# EAGLE design SparkX_Micro_NFC_RFID_Tag (EAGLE 9.6.2)
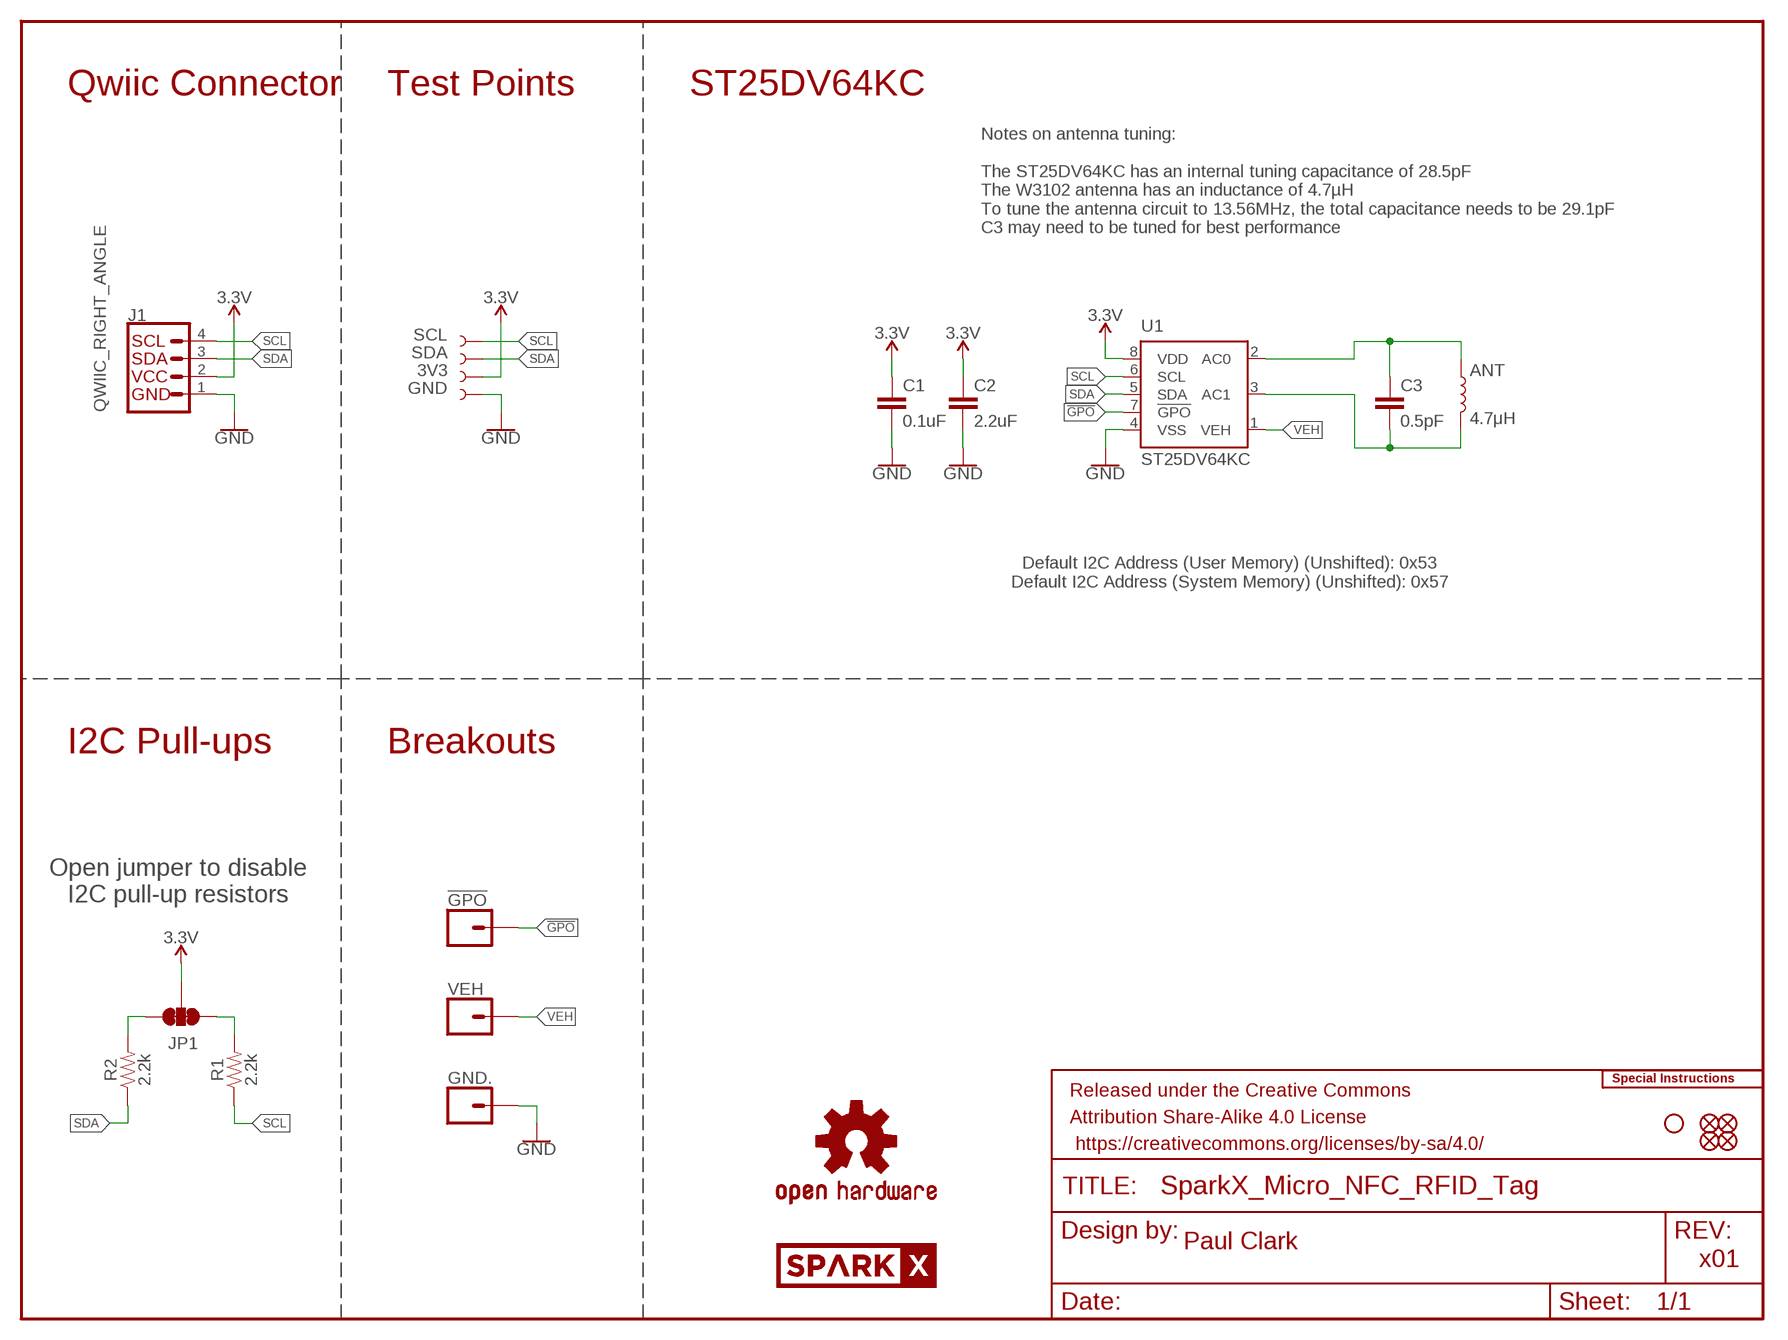
[diagram p0: schematic, sheet 1]

## Parts
3V3  TEST-POINT3  [PAD.03X.03]
!GPO!  CONN_01_1MM  [1X01_1MM_NO_SILK]
ANT  4.7μH  RFID_ANTENNA_W3102  [W3102]
C1  0.1uF  0.1UF-0402T-6.3V-10%-X7R  [0402-TIGHT]
C2  2.2uF  2.2UF-0402_TIGHT-10V-10%-X5R  [0402-TIGHT]
C3  0.5pF  0.5PF-0402_TIGHT-50V-PM0.05PF-NP0  [0402-TIGHT]
FD1  FIDUCIALUFIDUCIAL  [FIDUCIAL-MICRO]
FD2  FIDUCIALUFIDUCIAL  [FIDUCIAL-MICRO]
FD3  FIDUCIALUFIDUCIAL  [FIDUCIAL-MICRO]
FD4  FIDUCIALUFIDUCIAL  [FIDUCIAL-MICRO]
FRAME2  FRAME-LETTER  [CREATIVE_COMMONS]
GND  TEST-POINT3  [PAD.03X.03]
GND.  CONN_01_1MM  [1X01_1MM_NO_SILK]
H1  STAND-OFFTIGHT  [STAND-OFF-TIGHT]
J1  QWIIC_RIGHT_ANGLE  QWIIC_CONNECTORJS-1MM  [JST04_1MM_RA]
JP1  JUMPER-SMT_3_2-NC_TRACE_SILK  [SMT-JUMPER_3_2-NC_TRACE_SILK]
LOGO1  SPECIAL_INSTRUCTIONS-ORDERING  [ORDERING_INSTRUCTIONS]
LOGO2  OSHW-LOGOMINI  [OSHW-LOGO-MINI]
R1  2.2k  2.2KOHM-0402T-1/16W-1%  [0402-TIGHT]
R2  2.2k  2.2KOHM-0402T-1/16W-1%  [0402-TIGHT]
SCL  TEST-POINT3  [PAD.03X.03]
SDA  TEST-POINT3  [PAD.03X.03]
U1  ST25DV64KC  [SO08]
U$1  SPARKX-LOGO2  [SPARKX-TINY]
VEH  CONN_01_1MM  [1X01_1MM_NO_SILK]

## Nets
3.3V: 3V3.1 C1.1 C2.1 J1.2 JP1.2 U1.8(VDD)
!GPO!: !GPO!.1 U1.7(!GPO!)
GND: C1.2 C2.2 GND.1 GND..1 J1.1 U1.4(VSS)
N$1: ANT.2 C3.2 U1.3(AC1)
N$2: ANT.1 C3.1 U1.2(AC0)
N$3: JP1.3 R2.2
N$4: JP1.1 R1.2
SCL: J1.4 R1.1 SCL.1 U1.6(SCL)
SDA: J1.3 R2.1 SDA.1 U1.5(SDA)
VEH: U1.1(VEH) VEH.1

## Notes on the sheet
- Qwiic Connector | Test Points | ST25DV64KC
- Notes on antenna tuning:
  
  The ST25DV64KC has an internal tuning capacitance of 28.5pF
  The W3102 antenna has an inductance of 4.7µH
  To tune the antenna circuit to 13.56MHz, the total capacitance needs to be 29.1pF
  C3 may need to be tuned for best performance
- Default I2C Address (User Memory) (Unshifted): 0x53
  Default I2C Address (System Memory) (Unshifted): 0x57
- I2C Pull-ups | Breakouts
- Open jumper to disable
  I2C pull-up resistors
- Paul Clark
- x01

## Library data of the parts
3V3 GND SCL SDA = SparkFun-Connectors:TEST-POINT: SparkFun Test Points Bare copper test points for troubleshooting or In-Circuit-Testing. These are used by our Production team for verifying production board runs using pogo-pins on test beds. SparkFun Products: SparkFun LSM9DS1 Breakout <https://www.sparkfun.com/products/13284> SparkFun PSOC <https://www.sparkfun.com/products/13714> SparkFun Load Cell Amplifier <https://www.sparkfun.com/products/13879>
!GPO! GND. VEH = SparkFun-Connectors:CONN_01: Single connection point. Often used as Generic Header-pin footprint for 0.1 inch spaced/style header connections On any of the 0.1 inch spaced packages, you can populate with these: Break Away Headers - Straight <https://www.sparkfun.com/products/116> (PRT-00116) Break Away Male Headers - Right Angle <https://www.sparkfun.com/products/553> (PRT-00553) Female Headers <https://www.sparkfun.com/products/115> (PRT-00115) Break Away Headers - Machine Pin <https://www.sparkfun.com/products/117> (PRT-00117) Break Away Female Headers - Swiss Machine Pin <https://www.sparkfun.com/products/743> (PRT-00743) This device is also useful as a general connection point to wire up your design to another part of your project. Our various solder wires solder well into these plated through hole pads. Hook-Up Wire - Assortment (Stranded, 22 AWG) <https://www.sparkfun.com/products/11375> (PRT-11375) Hook-Up Wire - Assortment (Solid Core, 22 AWG) <https://www.sparkfun.com/products/11367> (PRT-11367) View the entire wire category on our website here <https://www.sparkfun.com/categories/141> Special notes: SMTSO-256-ET is a "flush mount" nut for a 4-40 screw. We mostly use this on specialty testbeds; it is a nice way to connect hardware to your PCB at an adjustable hieght. Also note, the SNAP packages are for using a snappable style connector. We sell a baggie of snaps and they are also used on two LilyPad designs: Snap Assortment - 30 pack (male and female) <https://www.sparkfun.com/products/11347> (DEV-11347) LilyPad Arduino SimpleSnap <https://www.sparkfun.com/products/10941> (DEV-10941) LilyPad SimpleSnap Protoboard <https://www.sparkfun.com/products/10940> (DEV-10940)
ANT = SparkFun-RF:RFID_ANTENNA_W3102: W3102 Pulse Larsen NFC / RFID SMD Antenna 13.56MHz 4.7μH; PROD_ID: ANT-16333
C1 = SparkFun-Capacitors:0.1UF: 0.1µF ceramic capacitors A capacitor is a passive two-terminal electrical component used to store electrical energy temporarily in an electric field.; PROD_ID: CAP-14993
C2 = SparkFun-Capacitors:2.2UF: 2.2µF ceramic capacitors A capacitor is a passive two-terminal electrical component used to store electrical energy temporarily in an electric field.; PROD_ID: CAP-14232
C3 = SparkFun-Capacitors:0.5PF: 0.5pF ceramic capacitors A capacitor is a passive two-terminal electrical component used to store electrical energy temporarily in an electric field.; PROD_ID: CAP-14362
FD1-FD4 = SparkFun-Aesthetics:FIDUCIAL: Fiducial Alignment Points Point-of-reference for pick-and-place machines and other optical instruments.
FRAME2 = SparkFun-Aesthetics:FRAME-LETTER: Schematic Frame - Letter Standard 8.5x11 US Letter frame
H1 = SparkFun-Hardware:STAND-OFF: Stand Off Drill holes for mechanically mounting via screws, standoffs, etc. Note: Use the keepout ring to avoid running the screw head into surrounding components. Variant Overviews STAND-OFF - Mechanical footprint for a #4 phillips button head screw. STAND-OFF-TIGHT - Mechanical footprint for a #4 phillips button head screw, Example SparkFun Products Screw - Phillips Head (1/4", 4-40, 10 pack) <https://www.sparkfun.com/products/10453> (PRT-10453) Screw - Phillips Head (1/2", 4-40, 10 pack) <https://www.sparkfun.com/products/10452> (PRT-10452) Screw - Phillips Head (3/4", 4-40, 10 pack) <https://www.sparkfun.com/products/10451> (PRT-10451) Screw - Phillips Head (1", 4-40, 10 pack) <https://www.sparkfun.com/products/10450> (PRT-10450)
J1 = SparkFun-Connectors:QWIIC_CONNECTOR: SparkFun I2C Standard Qwiic Connector An SMD 1mm pitch JST connector makes it easy and quick (get it? Qwiic?) to connect I2C devices to each other. The Qwiic system <http://www.sparkfun.com/qwiic> enables fast and solderless connection between popular platforms and various sensors and actuators. We carry 200mm <https://www.sparkfun.com/products/14204>, 100mm <https://www.sparkfun.com/products/14205>, 50mm <https://www.sparkfun.com/products/14206>, and breadboard friendly <https://www.sparkfun.com/products/14207> Qwiic cables. We also offer 10 pcs strips <https://www.sparkfun.com/products/14323> the SMD connectors.; PROD_ID: CONN-13694
JP1 = SparkFun-Jumpers:JUMPER-SMT_3_2-NC_TRACE: Normally closed trace jumper (2 of 2 connections) This jumper has a trace between all three pads so they are normally closed (NC). Use a razor knife to open the connection(s). For best results follow the IPC guidelines for cutting traces: Cutout at least 0.063 mm (0.005 in). Remove all loose material to clean up the cut area. Seal the cut with an approved epoxy. Reapply solder to reclose the connection(s).
LOGO1 = SparkFun-Aesthetics:SPECIAL_INSTRUCTIONS: Special Ordering/Production Instructions Alert Symbol for special PCB ordering instructions or unique production process warnings. Ordering Instructions Production Instructions Types of information that should be added to box: Copper weight Soldermask color Silk color PCB thickness Number of layers PCB Standard: 1.6mm FR4 1 oz copper immersion silver plating red soldermask white silkscreen Types of information that should be added to box: Special wash requirements Depaneling instructions Humidification Glue curing Default text settings: 0.07 inch 9% ratio 50% line distance
LOGO2 = SparkFun-Aesthetics:OSHW-LOGO: Open-Source Hardware (OSHW) Logo This logo indicates the piece of hardware it is found on incorporates a OSHW license and/or adheres to the definition of open source hardware found here: http://freedomdefined.org/OSHW
R1 R2 = SparkFun-Resistors:2.2KOHM: 2.2kΩ resistor A resistor is a passive two-terminal electrical component that implements electrical resistance as a circuit element. Resistors act to reduce current flow, and, at the same time, act to lower voltage levels within circuits. - Wikipedia; PROD_ID: RES-14341
U1 = SparkFun-RF:ST25DV64KC: Dynamic NFC/RFID Dynamic NFC/RFID tag IC with 4-Kbit, 16-Kbit or 64-Kbit EEPROM, fast transfer mode capability and optimized I2C.; PROD_ID: IC-16315
U$1 = SparkX:SPARKX-LOGO

## Net classes
1 Power: width 0.305 mm
2 3.3V: width 0.508 mm

## Board
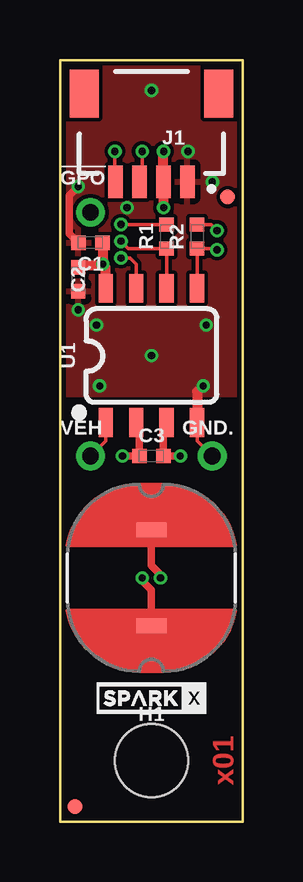
[diagram p1: board, top side]
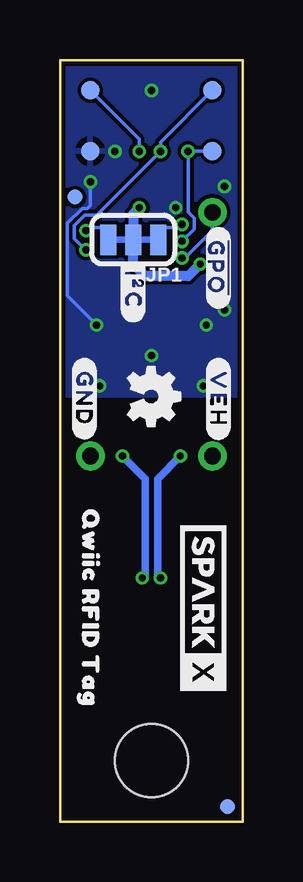
[diagram p2: board, bottom side, seen from below]

Size 7.62 x 31.75 mm. Coordinates in mm from the lower left corner, seen from the top.
Outline: 0,31.75 0,0 7.62,0 7.62,31.75 0,31.75
Copper layers (1*16): Top 0.035mm / dielectric 1.5mm / Bottom 0.035mm
Design rules "SparkFun-2-Layer-Minimum-JLCPCB": minimum track width 5mil, minimum drill 0.3mm, track to track 5mil, track to pad 5mil, pad to pad 5mil, via to via 5mil, smd to smd 5mil, copper to edge 7mil, drill to drill 7mil, minimum pad ring 5mil, minimum via ring 5mil, stop-mask expansion 2.5mil, vias tented up to drill 25mil, thermal gap 10mil

### Footprints (pad centres in the part's own frame; a part is rotated, then mirrored left to right if it is on the bottom)
PAD.03X.03 = smd 0.762 x 0.762: 1 0,0
1X01_1MM_NO_SILK = drill 0.7 pad 1.2: 1 0,0
W3102 = smd 1.27 x 0.635: 1 0,2; 2 0,-2
0402-TIGHT = smd 0.6 x 0.6: 1 -0.5,0; 2 0.5,0
FIDUCIAL-MICRO = smd 0.635 x 0.635: 1 0,0
STAND-OFF-TIGHT = hole 3.048: 0,0
JST04_1MM_RA = smd 0.6 x 1.35: 1 -1.5,0; 2 -0.5,0; 3 0.5,0; 4 1.5,0 | smd 1.2 x 2: NC1 2.8,-3.675; NC2 -2.8,-3.675
SMT-JUMPER_3_2-NC_TRACE_SILK = smd 0.66 x 1.27: 1 -1.041,0; 2 0,0; 3 1.041,0
SO08 = smd 0.6 x 1.2: 1 -1.905,-2.8; 2 -0.635,-2.8; 3 0.635,-2.8; 4 1.905,-2.8; 5 1.905,2.8; 6 0.635,2.8; 7 -0.635,2.8; 8 -1.905,2.8

### Placement (x,y rotation side)
3V3  6.35,30.48 0 bottom
!GPO!  1.27,25.4 0 top
ANT  3.81,10.16 180 top
C1  1.27,24.13 180 top
C2  0.76,22.61 270 top
C3  3.81,15.24 0 top
FD1  6.99,26.04 0 top
FD2  6.99,26.04 0 bottom
FD3  0.64,0.64 0 top
FD4  0.64,0.64 0 bottom
FRAME2  40.64,-10.16 0 top  (outside the outline)
GND  6.35,27.94 0 bottom
GND.  6.35,15.24 0 top
H1  3.81,2.54 0 top
J1  3.81,26.67 180 top
JP1  4.57,24.26 180 bottom
LOGO1  12.7,50.8 0 top  (outside the outline)
LOGO2  3.81,17.72 270 bottom
R1  4.45,24.38 90 top
R2  5.71,24.38 90 top
SCL  1.27,27.94 0 bottom
SDA  1.27,30.48 0 bottom
U1  3.81,19.43 0 top
U$1  3.81,5.14 0 top
U$2  [##GPO##0]  1.02,24.77 270 bottom
U$3  [QWIIC_RFID_TAG0]  6.35,8.89 270 bottom
U$4  [#VEH#0]  1.02,19.3 270 bottom
U$5  [#I�C#0]  4.57,23.5 270 bottom
U$6  [#GND#0]  6.6,19.3 270 bottom
U$20  SPARKX-LOGO3  [SPARKX-SMALL]  1.65,8.89 270 bottom
VEH  1.27,15.24 0 top

### Tracks (layer width: path | path; a pad name or v marks a point on that pad's centre or on a via)
3.3V  (via drill 0.3)
  Top 0.406: v4.32,25.59 v4.31,25.6 J1.2 v4.31,27.93 v4.32,27.94 | U1.8 1.91,23.11 v1.78,23.24 | C2.1 0.83,23.18 1.71,23.18 v1.78,23.24 | C1.1 v1.78,23.24
  Bottom 0.152: v4.32,27.94 4.32,28.45 3V3.1
  Bottom 0.406: v4.32,25.59 4.57,25.34 JP1.2 4.57,23.24 4.06,22.73 2.29,22.73 v1.78,23.24
!GPO!  (via drill 0.3)
  Top 0.152: U1.7 3.17,23.25 2.93,23.5 v2.54,23.5
  Bottom 0.152: !GPO!.1 1.27,24.64 2.41,23.5 v2.54,23.5
GND  (via drill 0.3)
  Top 0.152: U1.4 5.71,15.88 GND..1
  Top 0.305: C1.2 0.38,24.52 0.38,26.1 v0.76,26.48
  Top 0.406: v5.97,18.16 5.71,17.91 U1.4
  Bottom 0.152: v6.35,26.67 6.35,25.68 6.48,25.55 6.7,25.55 7.32,24.94 7.32,21.92 v6.1,20.7
  other vias: 1.65,18.16 1.52,20.7 0.76,21.34 5.33,27.94 3.81,19.43 2.79,25.59 3.81,30.48
  pour Bottom (isolate 0.152, rank 2): 0,31.75 7.62,31.75 7.62,17.78 0,17.78
  pour Top (isolate 0.152, rank 2): 0,31.75 7.62,31.75 7.62,17.78 0,17.78
N$1  (via drill 0.3)
  Top 0.305: U1.3 4.31,16.5 C3.2 v5.02,15.24 | ANT.2 3.81,10.67 4.19,10.29 v4.19,10.16
  Bottom 0.305: v5.02,15.24 4.06,14.29 4.06,10.29 v4.19,10.16
N$2  (via drill 0.3)
  Top 0.305: U1.2 3.31,16.5 C3.1 v2.6,15.24 | ANT.1 3.81,9.65 3.43,10.03 v3.43,10.16
  Bottom 0.305: v2.6,15.24 3.56,14.29 3.56,10.29 v3.43,10.16
N$3  (via drill 0.3)
  Top 0.152: v6.54,24.64 6.29,24.88 R2.2
  Bottom 0.152: v6.54,24.64 6.41,24.77 5.61,24.77 JP1.3
N$4  (via drill 0.3)
  Top 0.152: R1.2 4.44,24.89 v2.54,24.89
  Bottom 0.152: JP1.1 3.53,24.64 3.4,24.77 2.67,24.77 v2.54,24.89
SCL  (via drill 0.3)
  Top 0.152: J1.4 2.29,26.69 v2.29,27.94 | v2.54,24.19 2.85,23.88 R1.1 U1.6
  Bottom 0.152: SCL.1 v2.29,27.94 2.29,25.4 2.03,25.15 2.03,24.7 v2.54,24.19
SDA  (via drill 0.3)
  Top 0.152: v6.54,23.83 6.49,23.88 R2.1 U1.5 | J1.3 3.43,26.79 v3.43,27.94
  Bottom 0.152: SDA.1 3.43,28.32 v3.43,27.94 6.1,25.27 6.58,25.27 7.02,24.84 7.02,24.31 v6.54,23.83
VEH
  Top 0.152: U1.1 1.91,15.88 VEH.1

### Text on the board
Top: x01
Measures: Dimensions in Inches
tDocu: 2-Layer Board / 1.6mm Thickness / 1oz Copper / HASL Finish | Paul Clark